# EAGLE design ATmega168 RF 5V (EAGLE 5.06)
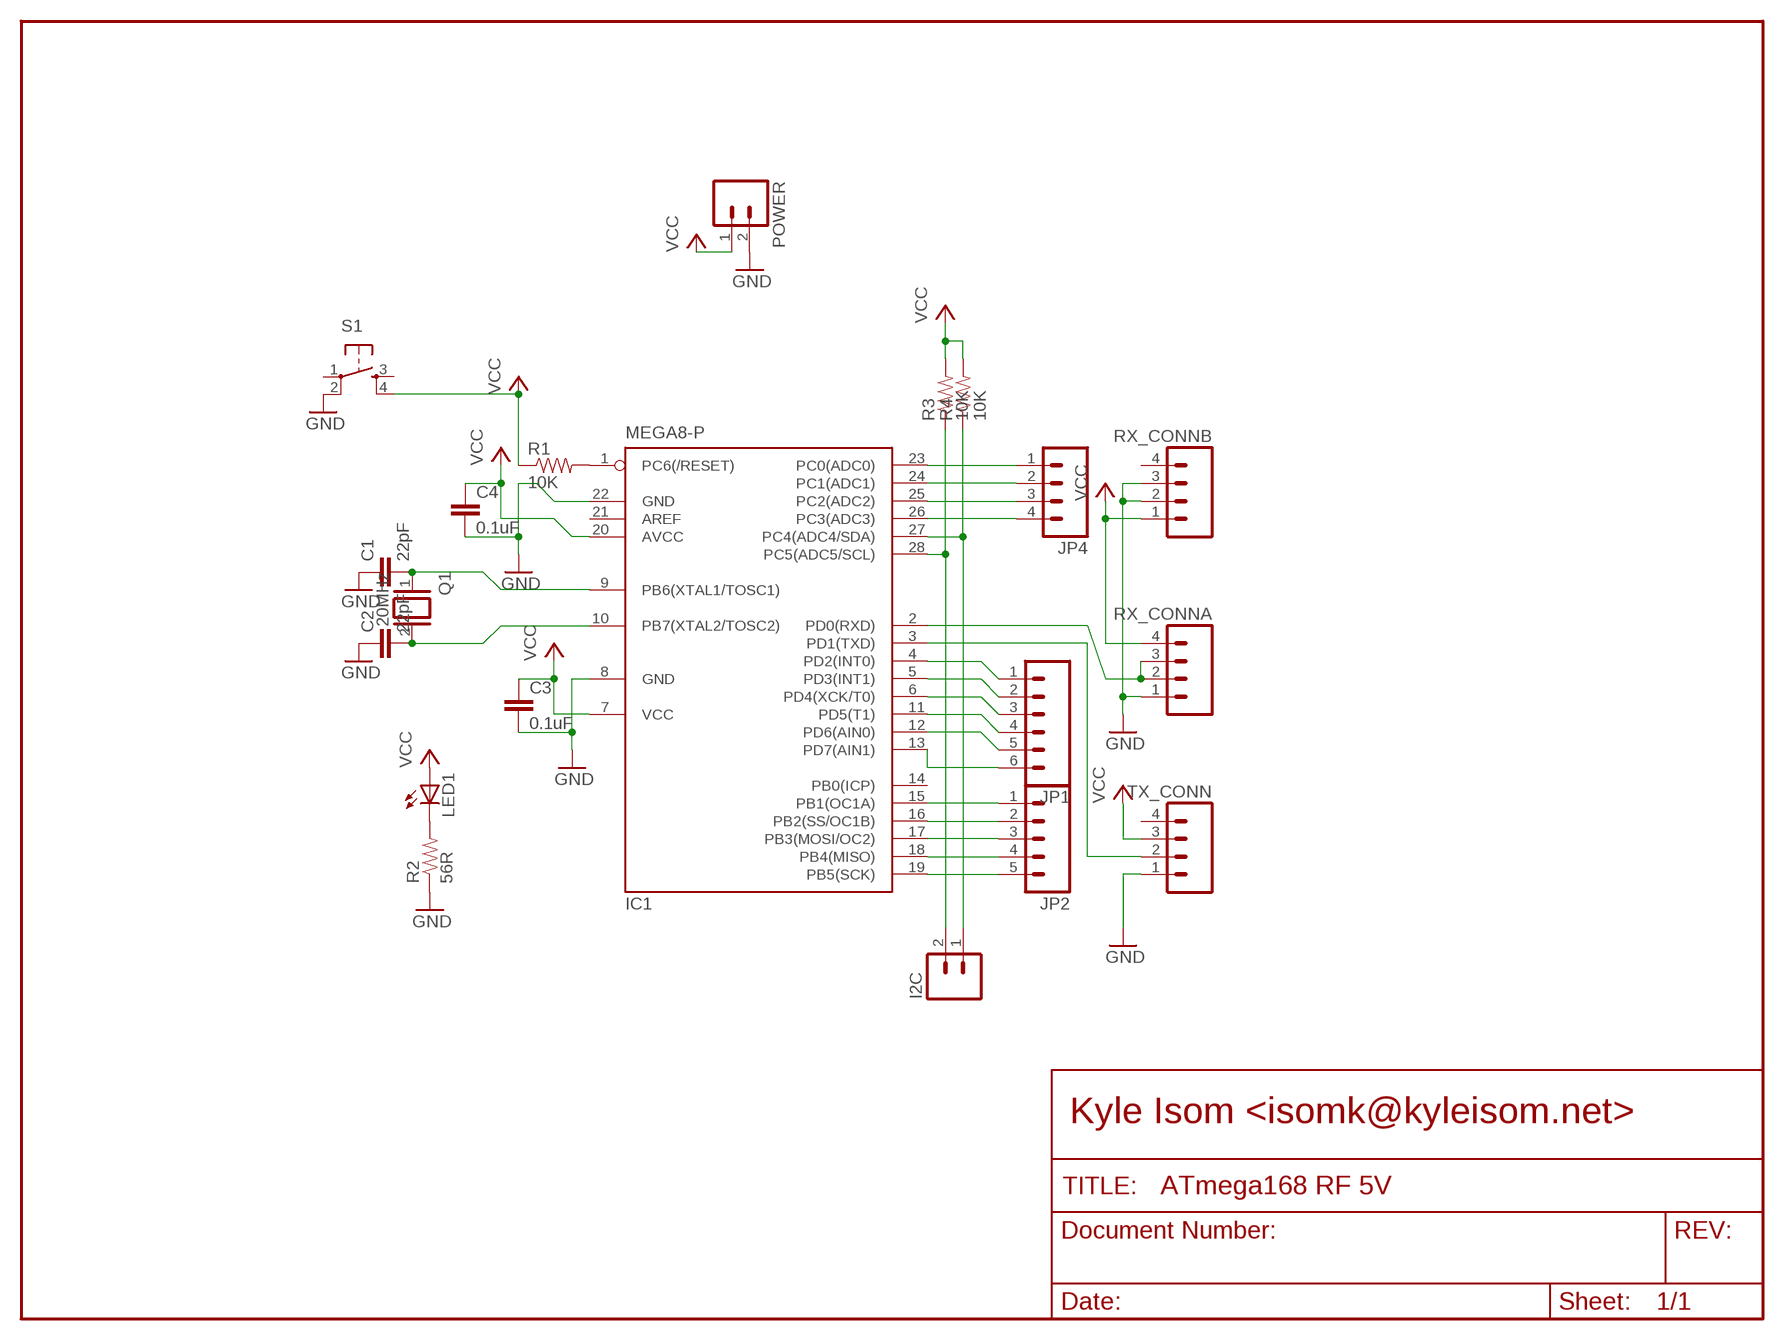
[diagram p0: schematic, sheet 1]

## Parts
C1  22pF  CAPPTH1  [CAP-PTH-5MM]
C2  22pF  CAPPTH1  [CAP-PTH-5MM]
C3  0.1uF  CAPPTH1  [CAP-PTH-5MM]
C4  0.1uF  CAPPTH1  [CAP-PTH-5MM]
I2C  M02LOCK  [1X02_LOCK]
IC1  MEGA8-P  [DIL28-3]
JP1  M06LOCK  [1X06_LOCK]
JP2  M05LOCK  [1X05_LOCK]
JP4  M04LOCK  [1X04_LOCK]
LED1  LED3MM  [LED3MM]
POWER  M02LOCK  [1X02_LOCK]
Q1  20MHz  XTAL/S  [QS]
R1  10K  RESISTORPTH1  [AXIAL-0.3]
R2  56R  RESISTORPTH1  [AXIAL-0.3]
R3  10K  RESISTORPTH1  [AXIAL-0.3]
R4  10K  RESISTORPTH1  [AXIAL-0.3]
RX_CONNA  M04LOCK  [1X04_LOCK]
RX_CONNB  M04LOCK  [1X04_LOCK]
S1  TAC_SWITCHPTH  [TACTILE-PTH]
TX_CONN  M04LOCK  [1X04_LOCK]

## Nets
GND: C1.1 C2.1 C3.2 C4.2 IC1.8(GND) IC1.22(GND) POWER.2 R2.P$1 RX_CONNA.1 RX_CONNB.2 RX_CONNB.3 S1.2 TX_CONN.1
N$1: IC1.2(PD0(RXD)) RX_CONNA.2 RX_CONNA.3
N$2: IC1.3(PD1(TXD)) TX_CONN.2
N$3: C1.2 IC1.9(PB6(XTAL1/TOSC1)) Q1.1
N$4: C2.2 IC1.10(PB7(XTAL2/TOSC2)) Q1.2
N$5: I2C.2 IC1.28(PC5(ADC5/SCL)) R3.P$1
N$6: I2C.1 IC1.27(PC4(ADC4/SDA)) R4.P$1
N$7: IC1.12(PD6(AIN0)) JP1.5
N$8: IC1.19(PB5(SCK)) JP2.5
N$9: IC1.18(PB4(MISO)) JP2.4
N$10: IC1.17(PB3(MOSI/OC2)) JP2.3
N$11: IC1.16(PB2(SS/OC1B)) JP2.2
N$12: IC1.15(PB1(OC1A)) JP2.1
N$13: IC1.13(PD7(AIN1)) JP1.6
N$14: IC1.11(PD5(T1)) JP1.4
N$15: IC1.6(PD4(XCK/T0)) JP1.3
N$16: IC1.5(PD3(INT1)) JP1.2
N$17: IC1.4(PD2(INT0)) JP1.1
N$18: IC1.23(PC0(ADC0)) JP4.1
N$19: IC1.24(PC1(ADC1)) JP4.2
N$20: IC1.25(PC2(ADC2)) JP4.3
N$21: IC1.26(PC3(ADC3)) JP4.4
N$22: IC1.1(PC6(/RESET)) R1.P$2
N$23: LED1.K(C) R2.P$2
VCC: C3.1 C4.1 IC1.7(VCC) IC1.20(AVCC) LED1.A POWER.1 R1.P$1 R3.P$2 R4.P$2 RX_CONNA.4 RX_CONNB.1 S1.4 TX_CONN.3
Unconnected: IC1.14(PB0(ICP)) IC1.21(AREF) RX_CONNB.4 S1.1 S1.3 TX_CONN.4

## Notes on the sheet
- Kyle Isom <isomk@kyleisom.net>

## Library data of the parts
C1-C4 = SparkFun:CAP: Capacitor Standard 0603 ceramic capacitor, and 0.1" leaded capacitor.
I2C POWER = SparkFun:M02: Header 2 Standard 2-pin 0.1" header. Use with straight break away headers (SKU : PRT-00116), right angle break away headers (PRT-00553), swiss pins (PRT-00743), machine pins (PRT-00117), and female headers (PRT-00115). Molex polarized connector foot print use with SKU : PRT-08233 with associated crimp pins and housings.
IC1 = atmel:MEGA8-P: MICROCONTROLLER 8 Kbytes FLASH, 1 kbytes SRAM, 512 bytes EEPROM, USART, 4-channel 10 bit ADC, 2-channel 8 bit ADC Pin compatible with Atmega48, ATMega88, ATMega168 Source: avr.lbr
JP1 = SparkFun:M06: Header 6 Standard 6-pin 0.1" header. Use with straight break away headers (SKU : PRT-00116), right angle break away headers (PRT-00553), swiss pins (PRT-00743), machine pins (PRT-00117), and female headers (PRT-00115). Molex polarized connector foot print use with SKU : PRT-08094 with associated crimp pins and housings. NOTES ON THE VARIANTS LOCK and LOCK_LONGPADS... This footprint was designed to help hold the alignment of a through-hole component (i.e. 6-pin header) while soldering it into place. You may notice that each hole has been shifted either up or down by 0.005 of an inch from it's more standard position (which is a perfectly straight line). This slight alteration caused the pins (the squares in the middle) to touch the edges of the holes. Because they are alternating, it causes a "brace" to hold the component in place. 0.005 has proven to be the perfect amount of "off-center" position when using our standard breakaway headers. Although looks a little odd when you look at the bare footprint, once you have a header in there, the alteration is very hard to notice. Also, if you push a header all the way into place, it is covered up entirely on the bottom side. This idea of altering the position of holes to aid alignment will be further integrated into the Sparkfun Library for other footprints. It can help hold any component with 3 or more connection pins.
JP2 = SparkFun:M05: Header 5 Standard 5-pin 0.1" header. Use with straight break away headers (SKU : PRT-00116), right angle break away headers (PRT-00553), swiss pins (PRT-00743), machine pins (PRT-00117), and female headers (PRT-00115). Molex polarized connector foot print use with SKU : PRT-08230 with associated crimp pins and housings.
JP4 RX_CONNA RX_CONNB TX_CONN = SparkFun:M04: Header 4 Standard 4-pin 0.1" header. Use with straight break away headers (SKU : PRT-00116), right angle break away headers (PRT-00553), swiss pins (PRT-00743), machine pins (PRT-00117), and female headers (PRT-00115). Molex polarized connector foot print use with SKU : PRT-08231 with associated crimp pins and housings.
LED1 = led:LED: LED OSRAM: - CHIPLED LG R971, LG N971, LY N971, LG Q971, LY Q971, LO R971, LY R971 LH N974, LH R974 LS Q976, LO Q976, LY Q976 LO Q996 - Hyper CHIPLED LW Q18S LB Q993, LB Q99A, LB R99A - SideLED LS A670, LO A670, LY A670, LG A670, LP A670 LB A673, LV A673, LT A673, LW A673 LH A674 LY A675 LS A676, LA A676, LO A676, LY A676, LW A676 LS A679, LY A679, LG A679 - Hyper Micro SIDELED® LS Y876, LA Y876, LO Y876, LY Y876 LT Y87S - SmartLED LW L88C, LW L88S LB L89C, LB L89S, LG L890 LS L89K, LO L89K, LY L89K LS L896, LA L896, LO L896, LY L896 - TOPLED LS T670, LO T670, LY T670, LG T670, LP T670 LSG T670, LSP T670, LSY T670, LOP T670, LYG T670 LG T671, LOG T671, LSG T671 LB T673, LV T673, LT T673, LW T673 LH T674 LS T676, LA T676, LO T676, LY T676, LB T676, LH T676, LSB T676, LW T676 LB T67C, LV T67C, LT T67C, LS T67K, LO T67K, LY T67K, LW E67C LS E67B, LA E67B, LO E67B, LY E67B, LB E67C, LV E67C, LT E67C LW T67C LS T679, LY T679, LG T679 LS T770, LO T770, LY T770, LG T770, LP T770 LB T773, LV T773, LT T773, LW T773 LH T774 LS E675, LA E675, LY E675, LS T675 LS T776, LA T776, LO T776, LY T776, LB T776 LHGB T686 LT T68C, LB T68C - Hyper Mini TOPLED® LB M676 - Mini TOPLED Santana® LG M470 LS M47K, LO M47K, LY M47K Source: http://www.osram.convergy.de LUXEON: - LUMILED® LXK2-PW12-R00, LXK2-PW12-S00, LXK2-PW14-U00, LXK2-PW14-V00 LXK2-PM12-R00, LXK2-PM12-S00, LXK2-PM14-U00 LXK2-PE12-Q00, LXK2-PE12-R00, LXK2-PE12-S00, LXK2-PE14-T00, LXK2-PE14-U00 LXK2-PB12-K00, LXK2-PB12-L00, LXK2-PB12-M00, LXK2-PB14-N00, LXK2-PB14-P00, LXK2-PB14-Q00 LXK2-PR12-L00, LXK2-PR12-M00, LXK2-PR14-Q00, LXK2-PR14-R00 LXK2-PD12-Q00, LXK2-PD12-R00, LXK2-PD12-S00 LXK2-PH12-R00, LXK2-PH12-S00 LXK2-PL12-P00, LXK2-PL12-Q00, LXK2-PL12-R00 Source: www.luxeon.com KINGBRIGHT: KA-3528ASYC Source: www.kingbright.com
Q1 = special:XTAL/S: CRYSTAL
R1-R4 = SparkFun:RESISTOR: Resistor Basic schematic elements and footprints for 0603, 1206, and PTH 1/10th watt (small) resistors.
S1 = SparkFun:TAC_SWITCH: Momentary Switch Button commonly used for reset or general input. Spark Fun Electronics SKU : COM-00097

## Board
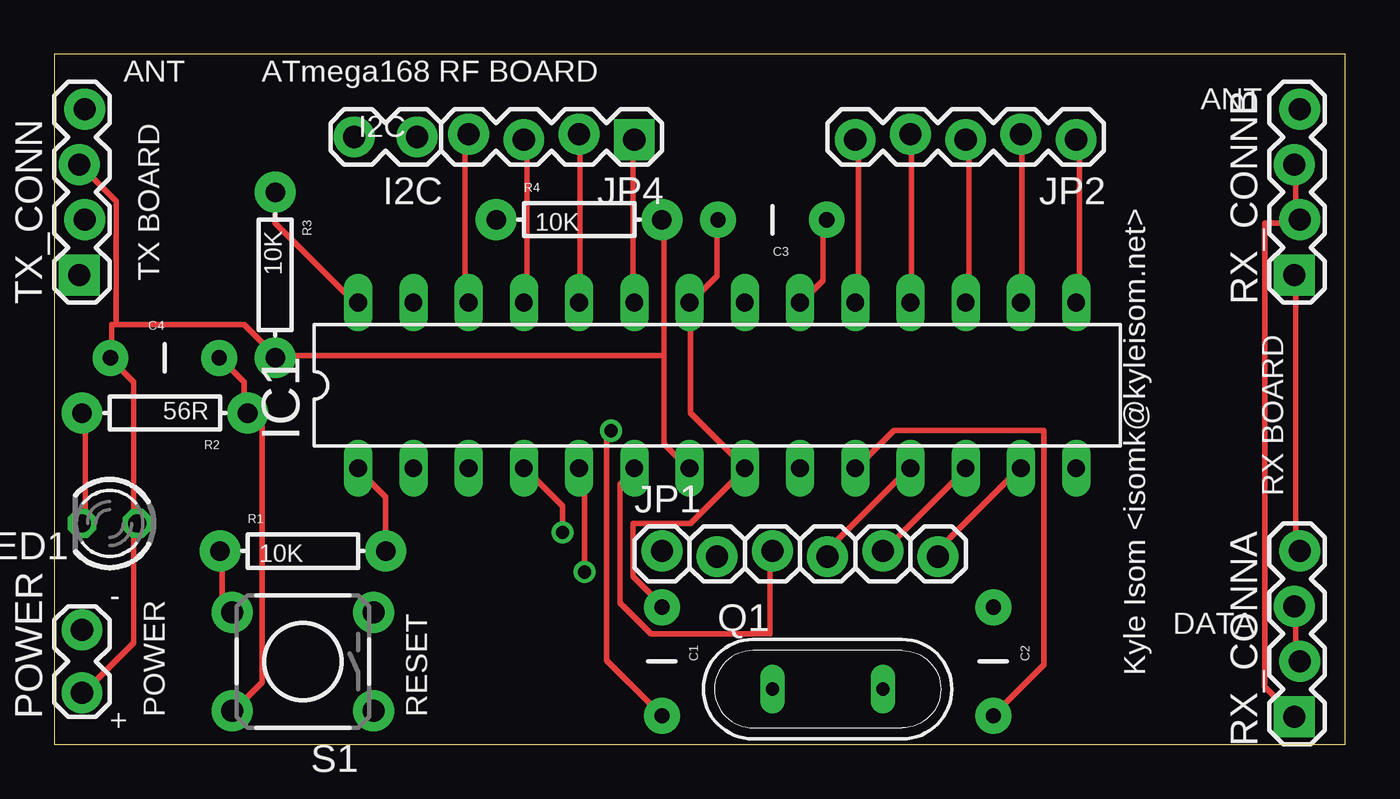
[diagram p1: board, top side]
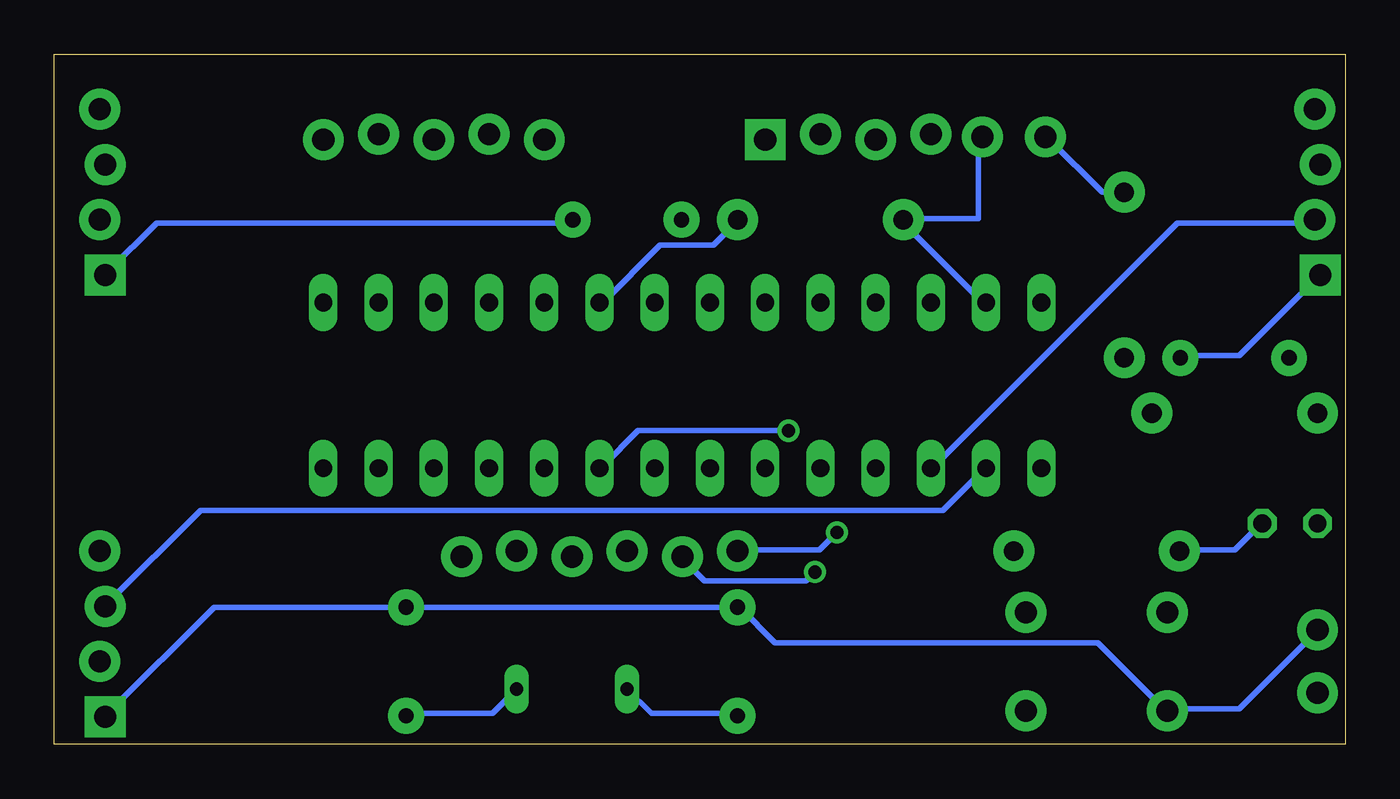
[diagram p2: board, bottom side, seen from below]

Size 59.36 x 31.74 mm. Coordinates in mm from the lower left corner, seen from the top.
Outline: 0,0 59.36,0 59.36,31.74 0,31.74 0,0
Copper layers (1*16): Top 0.035mm / dielectric 1.5mm / Bottom 0.035mm
Design rules "default": minimum track width 10mil, minimum drill 24mil, track to track 8mil, track to pad 8mil, pad to pad 8mil, via to via 8mil, smd to smd 8mil, copper to edge 40mil, drill to drill 8mil, minimum pad ring 10mil, minimum via ring 8mil, stop-mask expansion 4mil, vias tented up to drill 0mil, thermal gap 10mil

### Footprints (pad centres in the part's own frame; a part is rotated, then mirrored left to right if it is on the bottom)
CAP-PTH-5MM = drill 0.7 pad 1.651 round: 1 -2.5,0; 2 2.5,0
1X02_LOCK = drill 1.016 pad 1.88 round: 1 -0.178,0; 2 2.718,0
DIL28-3 = drill 0.813 long: 1 -16.51,-3.81; 2 -13.97,-3.81; 3 -11.43,-3.81; 4 -8.89,-3.81; 5 -6.35,-3.81; 6 -3.81,-3.81; 7 -1.27,-3.81; 8 1.27,-3.81; 9 3.81,-3.81; 10 6.35,-3.81; 11 8.89,-3.81; 12 11.43,-3.81; 13 13.97,-3.81; 14 16.51,-3.81; 15 16.51,3.81; 16 13.97,3.81; 17 11.43,3.81; 18 8.89,3.81; 19 6.35,3.81; 20 3.81,3.81; 21 1.27,3.81; 22 -1.27,3.81; 23 -3.81,3.81; 24 -6.35,3.81; 25 -8.89,3.81; 26 -11.43,3.81; 27 -13.97,3.81; 28 -16.51,3.81
1X06_LOCK = drill 1.016 pad 1.88 round: 1 0,0; 2 2.54,-0.254; 3 5.08,0; 4 7.62,-0.254; 5 10.16,0; 6 12.7,-0.254
1X05_LOCK = drill 1.016 pad 1.88 round: 1 0,0.127; 2 2.54,-0.127; 3 5.08,0.127; 4 7.62,-0.127; 5 10.16,0.127
1X04_LOCK = drill 1.016 pad 1.88 square: 1 0,0.127 | drill 1.016 pad 1.88 round: 2 2.54,-0.127; 3 5.08,0.127; 4 7.62,-0.127
LED3MM = drill 0.813 octagon: A -1.27,0; K 1.27,0
QS = drill 0.61 long: 1 -2.54,0; 2 2.54,0
AXIAL-0.3 = drill 0.9 pad 1.88 round: P$1 -3.81,0; P$2 3.81,0
TACTILE-PTH = drill 1.016 pad 1.88 round: 1 -3.251,2.261; 2 3.251,2.261; 3 -3.251,-2.261; 4 3.251,-2.261

### Placement (x,y rotation side)
C1  27.94,3.81 270 top
C2  43.18,3.81 270 top
C3  33.02,24.13 180 top
C4  5.08,17.78 0 top
I2C  16.51,27.94 180 top
IC1  30.48,16.51 0 top
JP1  27.94,8.89 0 top
JP2  46.99,27.94 180 top
JP4  26.67,27.94 180 top
LED1  2.54,10.16 180 top
POWER  1.27,2.54 90 top
Q1  35.56,2.54 0 top
R1  11.43,8.89 0 top
R2  5.08,15.24 180 top
R3  10.16,21.59 270 top
R4  24.13,24.13 0 top
RX_CONNA  57.15,1.27 90 top
RX_CONNB  57.15,21.59 90 top
S1  11.43,3.81 180 top
TX_CONN  1.27,21.59 90 top

### Tracks (layer width: path | path; a pad name or v marks a point on that pad's centre or on a via)
GND
  Top 0.254: C4.2 7.72,17.68 8.74,16.66 8.74,15.24 R2.P$1 8.94,15.24 9.55,14.63 9.55,2.85 8.33,1.63 S1.2 | 29.26,20.32 30.48,21.54 30.48,23.98 C3.2 | 29.26,20.32 29.26,15.24 31.7,12.8 IC1.8 31.7,12.6 29.26,10.16 26.62,10.16 26.62,7.72 27.84,6.5 C1.1 | 29.26,20.32 IC1.22 | RX_CONNB.3 57.1,26.62 57.1,24.18 RX_CONNB.2 57.1,23.98 55.68,23.98 55.68,2.64 56.9,1.42 RX_CONNA.1
  Bottom 0.254: POWER.2 1.42,5.08 4.88,1.63 8.13,1.63 S1.2 8.33,1.63 11.38,4.67 26.21,4.67 27.84,6.3 C1.1 28.04,6.3 43.08,6.3 C2.1 43.28,6.3 52.02,6.3 56.9,1.42 RX_CONNA.1 | TX_CONN.1 1.22,21.54 4.88,17.88 7.52,17.88 C4.2
N$1
  Top 0.254: RX_CONNA.2 57.1,3.86 57.1,6.3 RX_CONNA.3
  Bottom 0.254: IC1.2 16.66,12.6 18.49,10.77 52.63,10.77 56.9,6.5 RX_CONNA.3
N$2
  Bottom 0.254: IC1.3 18.9,12.8 7.72,23.98 1.42,23.98 TX_CONN.2
N$3  (via drill 0.61)
  Top 0.254: v25.6,14.43 25.4,14.22 25.4,3.86 27.84,1.42 C1.2
  Bottom 0.254: Q1.1 31.9,1.42 28.04,1.42 C1.2 | v25.6,14.43 32.51,14.43 34.14,12.8 IC1.9
N$4
  Top 0.254: IC1.10 36.98,12.8 38.61,14.43 45.52,14.43 45.52,3.66 43.28,1.42 C2.2
  Bottom 0.254: Q1.2 39.22,1.42 43.08,1.42 C2.2
N$5
  Top 0.254: R3.P$1 10.16,23.98 13.82,20.32 IC1.28
  Bottom 0.254: R3.P$1 11.18,25.4 13.61,27.84 I2C.2
N$6
  Bottom 0.254: IC1.27 16.66,20.32 20.32,23.98 R4.P$1 20.32,24.18 16.87,24.18 16.87,27.84 I2C.1
N$7
  Top 0.254: IC1.12 41.86,12.6 38.2,8.94 JP1.5
N$8
  Top 0.254: IC1.19 36.98,20.32 36.98,27.64 JP2.5
N$9
  Top 0.254: IC1.18 39.42,20.32 39.42,28.04 JP2.4
N$10
  Top 0.254: IC1.17 42.06,20.32 42.06,27.64 JP2.3
N$11
  Top 0.254: IC1.16 44.5,20.32 44.5,28.04 JP2.2
N$12
  Top 0.254: IC1.15 47.14,20.32 47.14,27.64 JP2.1
N$13
  Top 0.254: IC1.13 44.3,12.6 40.64,8.94 JP1.6
N$14
  Top 0.254: IC1.11 39.22,12.6 35.56,8.94 JP1.4
N$15
  Top 0.254: IC1.6 26.62,12.6 26.01,11.99 26.01,6.5 27.43,5.08 32.92,5.08 32.92,8.74 JP1.3
N$16  (via drill 0.61)
  Top 0.254: v24.38,7.92 24.38,12.39 24.18,12.6 IC1.5
  Bottom 0.254: v24.38,7.92 24.79,7.52 29.46,7.52 30.48,8.53 JP1.2
N$17  (via drill 0.61)
  Top 0.254: v23.37,9.75 23.37,10.97 21.74,12.6 IC1.4
  Bottom 0.254: v23.37,9.75 24.18,8.94 27.84,8.94 JP1.1
N$18
  Top 0.254: IC1.23 26.62,20.32 26.62,27.64 JP4.1
N$19
  Top 0.254: IC1.24 24.18,20.32 24.18,28.04 JP4.2
N$20
  Top 0.254: IC1.25 21.74,20.32 21.74,27.64 JP4.3
N$21
  Top 0.254: IC1.26 18.9,20.32 18.9,28.04 JP4.4
N$22
  Top 0.254: IC1.1 14.02,12.6 15.24,11.38 R1.P$2
N$23
  Top 0.254: LED1.K 1.42,10.16 1.42,15.24 R2.P$2
VCC
  Top 0.254: 3.66,10.16 3.66,16.66 2.64,17.68 C4.1 2.64,17.88 2.64,19.3 2.85,19.3 | 3.66,10.16 3.66,4.67 1.42,2.44 POWER.1 | 3.66,10.16 LED1.A | S1.4 8.13,6.1 7.72,6.5 7.72,8.74 R1.P$1 | 10.16,17.88 8.74,19.3 2.85,19.3 | 2.85,19.3 2.85,24.99 1.22,26.62 TX_CONN.3 | RX_CONNB.1 57.1,21.54 57.1,8.94 RX_CONNA.4 | IC1.20 34.34,20.32 35.36,21.34 35.36,23.98 C3.1 | 28.04,17.88 28.04,23.98 R4.P$2 | 28.04,17.88 28.04,13.82 29.06,12.8 IC1.7 | 10.16,17.88 28.04,17.88 | 10.16,17.88 R3.P$2
  Bottom 0.254: LED1.A 3.86,10.16 5.08,8.94 7.52,8.94 R1.P$1 | IC1.20 34.14,20.32 31.5,22.96 29.06,22.96 28.04,23.98 R4.P$2 | RX_CONNB.1 56.9,21.74 54.66,23.98 35.56,23.98 C3.1

### Text on the board
tPlace: ANT | ATmega168 RF BOARD | TX BOARD | ANT | I2C | RX BOARD | - | DATA | Kyle Isom <isomk@kyleisom.net> | + | POWER | RESET